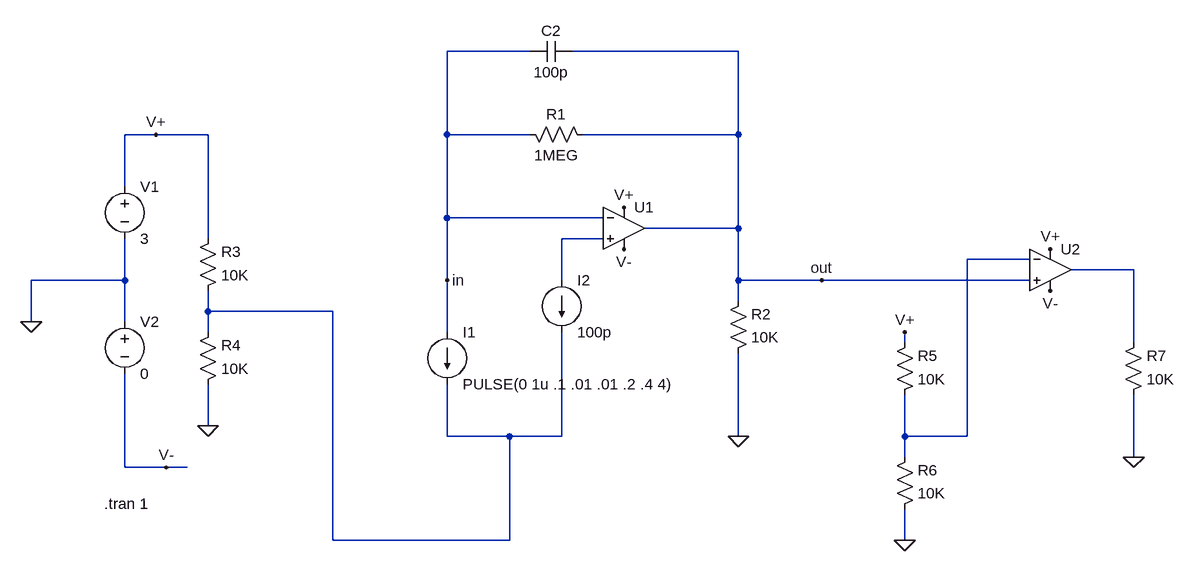
[diagram p0: schematic TransimpedenceAmplifier-01.asc]
TransimpedenceAmplifier-01.asc, the LTspice schematic file:
Version 4
SHEET 1 1688 680
WIRE 688 -144 560 -144
WIRE 1008 -144 752 -144
WIRE 112 -16 64 -16
WIRE 192 -16 112 -16
WIRE 560 -16 560 -144
WIRE 688 -16 560 -16
WIRE 1008 -16 1008 -144
WIRE 1008 -16 768 -16
WIRE 64 64 64 -16
WIRE 560 112 560 -16
WIRE 800 112 560 112
WIRE 1008 128 1008 -16
WIRE 1008 128 864 128
WIRE 192 144 192 -16
WIRE 800 144 736 144
WIRE 1456 176 1360 176
WIRE 1616 192 1520 192
WIRE 64 208 64 144
WIRE 64 208 -80 208
WIRE 560 208 560 112
WIRE 736 208 736 144
WIRE 1008 208 1008 128
WIRE 1136 208 1008 208
WIRE 1456 208 1136 208
WIRE 1008 240 1008 208
WIRE 192 256 192 224
WIRE 384 256 192 256
WIRE -80 272 -80 208
WIRE 64 272 64 208
WIRE 192 288 192 256
WIRE 560 288 560 208
WIRE 1264 304 1264 288
WIRE 1616 304 1616 192
WIRE 192 432 192 368
WIRE 560 448 560 368
WIRE 656 448 560 448
WIRE 736 448 736 288
WIRE 736 448 656 448
WIRE 1008 448 1008 320
WIRE 1264 448 1264 384
WIRE 1360 448 1360 176
WIRE 1360 448 1264 448
WIRE 1264 480 1264 448
WIRE 1616 480 1616 384
WIRE 64 496 64 352
WIRE 128 496 64 496
WIRE 160 496 128 496
WIRE 384 608 384 256
WIRE 656 608 656 448
WIRE 656 608 384 608
WIRE 1264 608 1264 560
FLAG 112 -16 V+
FLAG 128 496 V-
FLAG 832 96 V+
FLAG 832 160 V-
FLAG -80 272 0
FLAG 192 432 0
FLAG 1008 448 0
FLAG 1264 288 V+
FLAG 1616 480 0
FLAG 1264 608 0
FLAG 1488 160 V+
FLAG 1488 224 V-
FLAG 560 208 in
FLAG 1136 208 out
SYMBOL voltage 64 48 R0
WINDOW 123 0 0 Left 2
WINDOW 39 0 0 Left 2
SYMATTR InstName V1
SYMATTR Value 3
SYMBOL voltage 64 256 R0
WINDOW 123 0 0 Left 2
WINDOW 39 0 0 Left 2
SYMATTR InstName V2
SYMATTR Value 0
SYMBOL Opamps\\UniversalOpamp2 832 128 R0
SYMATTR InstName U1
SYMATTR Value2 Avol=100k GBW=1Meg Slew=500k
SYMBOL current 560 288 R0
WINDOW 123 0 0 Left 2
WINDOW 39 0 0 Left 2
SYMATTR InstName I1
SYMATTR Value PULSE(0 1u .1 .01 .01 .2 .4 4)
SYMBOL res 784 0 M270
WINDOW 0 32 56 VTop 2
WINDOW 3 0 56 VBottom 2
SYMATTR InstName R1
SYMATTR Value 1MEG
SYMBOL res 992 336 M180
WINDOW 0 36 76 Left 2
WINDOW 3 36 40 Left 2
SYMATTR InstName R2
SYMATTR Value 10K
SYMBOL current 736 208 R0
WINDOW 123 0 0 Left 2
WINDOW 39 0 0 Left 2
SYMATTR InstName I2
SYMATTR Value 100p
SYMBOL res 176 240 M180
WINDOW 0 36 76 Left 2
WINDOW 3 36 40 Left 2
SYMATTR InstName R3
SYMATTR Value 10K
SYMBOL res 176 384 M180
WINDOW 0 36 76 Left 2
WINDOW 3 36 40 Left 2
SYMATTR InstName R4
SYMATTR Value 10K
SYMBOL Opamps\\UniversalOpamp2 1488 192 R0
SYMATTR InstName U2
SYMATTR Value2 Avol=100k GBW=1Meg Slew=500k
SYMBOL res 1248 400 M180
WINDOW 0 36 76 Left 2
WINDOW 3 36 40 Left 2
SYMATTR InstName R5
SYMATTR Value 10K
SYMBOL res 1248 576 M180
WINDOW 0 36 76 Left 2
WINDOW 3 36 40 Left 2
SYMATTR InstName R6
SYMATTR Value 10K
SYMBOL res 1600 400 M180
WINDOW 0 36 76 Left 2
WINDOW 3 36 40 Left 2
SYMATTR InstName R7
SYMATTR Value 10K
SYMBOL cap 752 -160 R90
WINDOW 0 0 32 VBottom 2
WINDOW 3 32 32 VTop 2
SYMATTR InstName C2
SYMATTR Value 100p
TEXT 32 552 Left 2 !.tran 1

The netlist it stands for:
* TransimpedenceAmplifier-01.asc
V1 V+ 0 3
V2 0 V- 0
XU1 N001 in V+ V- out level.2 Avol=100k GBW=1Meg Slew=500k ilimit=25m rail=0 Vos=0 phimargin=45 en=0 enk=0 in=0 ink=0 Rin=500Meg  ; pins IN+ IN- V+ V- OUT
I1 in N004 PULSE(0 1u .1 .01 .01 .2 .4 4)
R1 out in 1MEG
R2 0 out 10K
I2 N001 N004 100p
R3 N004 V+ 10K
R4 0 N004 10K
XU2 out N002 V+ V- N003 level.2 Avol=100k GBW=1Meg Slew=500k ilimit=25m rail=0 Vos=0 phimargin=45 en=0 enk=0 in=0 ink=0 Rin=500Meg  ; pins IN+ IN- V+ V- OUT
R5 N002 V+ 10K
R6 0 N002 10K
R7 0 N003 10K
C2 out in 100p
.tran 1
.lib UniversalOpamps2.sub
.backanno
.end